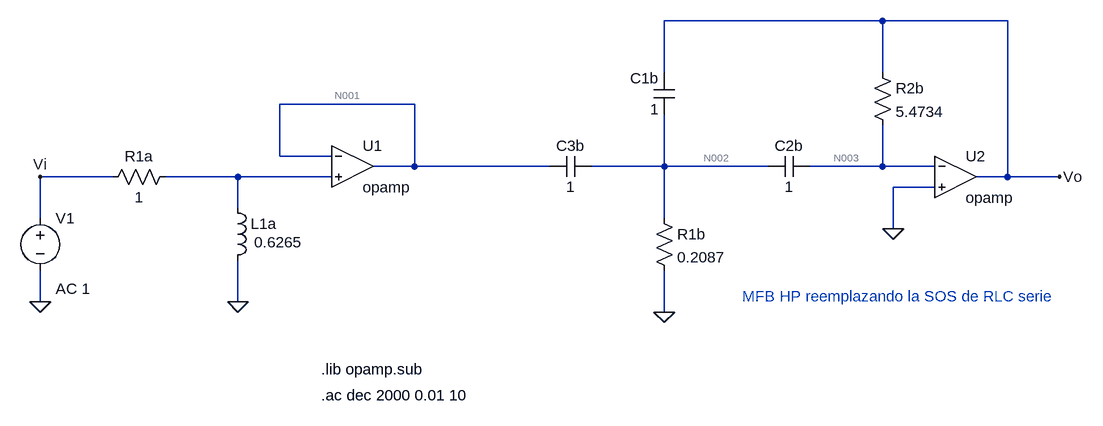
[diagram p0: schematic con_MFB.asc]
con_MFB.asc, the LTspice schematic file:
Version 4.1
SHEET 1 1504 680
WIRE 1184 -96 848 -96
WIRE 1376 -96 1184 -96
WIRE 848 -16 848 -96
WIRE 1184 -16 1184 -96
WIRE 464 32 256 32
WIRE 256 112 256 32
WIRE 336 112 256 112
WIRE 464 128 464 32
WIRE 464 128 400 128
WIRE 672 128 464 128
WIRE 848 128 848 48
WIRE 848 128 736 128
WIRE 1008 128 848 128
WIRE 1184 128 1184 64
WIRE 1184 128 1072 128
WIRE 1264 128 1184 128
WIRE 0 144 -112 144
WIRE 192 144 80 144
WIRE 336 144 192 144
WIRE 1376 144 1376 -96
WIRE 1376 144 1328 144
WIRE 1456 144 1376 144
WIRE 1264 160 1200 160
WIRE 192 192 192 144
WIRE -112 208 -112 144
WIRE 848 208 848 128
WIRE 1200 224 1200 160
WIRE -112 336 -112 288
WIRE 192 336 192 272
WIRE 848 352 848 288
FLAG 192 336 0
FLAG -112 336 0
FLAG 848 352 0
FLAG 1200 224 0
FLAG 1456 144 Vo
FLAG -112 144 Vi
SYMBOL res 96 128 R90
WINDOW 0 0 56 VBottom 2
WINDOW 3 32 56 VTop 2
SYMATTR InstName R1a
SYMATTR Value 1
SYMBOL voltage -112 192 R0
WINDOW 123 24 124 Left 2
WINDOW 39 0 0 Left 0
SYMATTR InstName V1
SYMATTR Value ""
SYMATTR Value2 AC 1
SYMBOL ind 176 176 R0
WINDOW 3 41 69 Left 2
SYMATTR InstName L1a
SYMATTR Value 0.6265
SYMBOL OpAmps\\opamp 368 64 R0
SYMATTR InstName U1
SYMBOL cap 736 112 R90
WINDOW 0 0 32 VBottom 2
WINDOW 3 32 32 VTop 2
SYMATTR InstName C3b
SYMATTR Value 1
SYMBOL cap 1072 112 R90
WINDOW 0 0 32 VBottom 2
WINDOW 3 32 32 VTop 2
SYMATTR InstName C2b
SYMATTR Value 1
SYMBOL cap 864 48 R180
WINDOW 0 24 56 Left 2
WINDOW 3 24 8 Left 2
SYMATTR InstName C1b
SYMATTR Value 1
SYMBOL res 832 192 R0
SYMATTR InstName R1b
SYMATTR Value 0.2087
SYMBOL res 1168 -32 R0
SYMATTR InstName R2b
SYMATTR Value 5.4734
SYMBOL OpAmps\\opamp 1296 80 R0
SYMATTR InstName U2
TEXT 968 328 Left 2 ;MFB HP reemplazando la SOS de RLC serie
TEXT 320 440 Left 2 !.lib opamp.sub
TEXT 320 480 Left 2 !.ac dec 2000 0.01 10

The netlist it stands for:
* con_MFB.asc
R1a N004 Vi 1
V1 Vi 0 AC 1
L1a N004 0 0.6265
X§U1 N001 N004 N001 opamp Aol=100K GBW=10Meg  ; pins invin noninvin out
C3b N002 N001 1
C2b N003 N002 1
C1b N002 Vo 1
R1b N002 0 0.2087
R2b Vo N003 5.4734
X§U2 N003 0 Vo opamp Aol=100K GBW=10Meg  ; pins invin noninvin out
* MFB HP reemplazando la SOS de RLC serie
.lib opamp.sub
.ac dec 2000 0.01 10
.backanno
.end

* Results of the author's LTspice run, read from the files saved beside the schematic
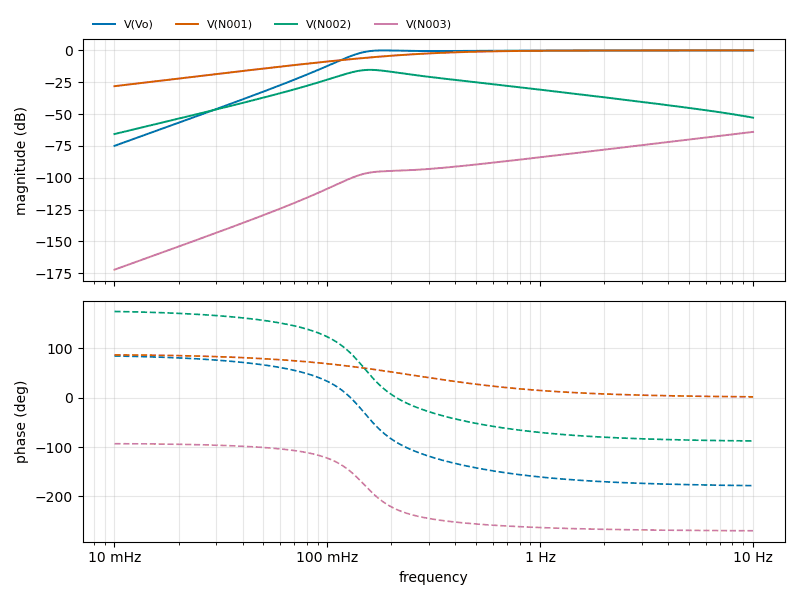
[diagram p1: AC Analysis of con_MFB.asc, plotted from the saved traces]
* AC Analysis, 1 run:
*   V(Vo): -75.00 dB at 10 mHz, -0.00 dB at 10 Hz, peak -0.00 dB at 10 Hz, 3 dB below the peak at 136.3 mHz
*   V(N001): -28.11 dB at 10 mHz, -0.00 dB at 10 Hz, peak -0.00 dB at 10 Hz, 3 dB below the peak at 254.1 mHz
*   V(N002): -65.72 dB at 10 mHz, -52.85 dB at 10 Hz, peak -15.27 dB at 158.9 mHz, 3 dB below the peak at 123.3 mHz and 230.5 mHz
*   V(N003): -172.28 dB at 10 mHz, -64.02 dB at 10 Hz, peak -64.02 dB at 10 Hz, 3 dB below the peak at 7.07 Hz